# EAGLE design circuito_visualizacion (EAGLE 6.1)
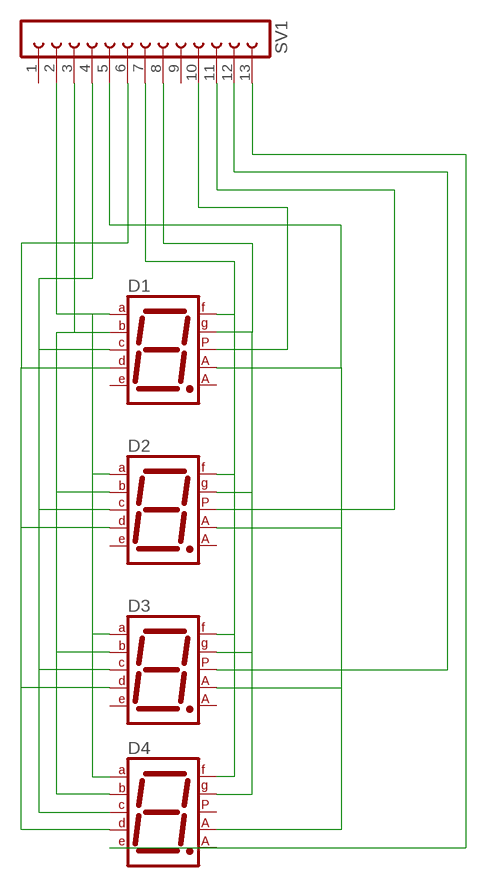
[diagram p0: schematic, sheet 1]

## Parts
D1  7SEG-CA  [7SEG-13]
D2  7SEG-CA  [7SEG-13]
D3  7SEG-CA  [7SEG-13]
D4  7SEG-CA  [7SEG-13]
SV1  FE13-1  [FE13]

## Nets
N$1: D3.5(DP) SV1.12
N$2: D4.1(E) SV1.13
N$3: D1.5(DP) SV1.10
N$5: D1.7(A) D2.7(A) D3.7(A) D4.7(A) SV1.2
N$6: D1.6(B) D2.6(B) D3.6(B) D4.6(B) SV1.3
N$7: D1.4(C) D2.4(C) D3.4(C) D4.4(C) SV1.4
N$8: D1.2(D) D2.2(D) D3.2(D) D4.2(D) SV1.6
N$9: D1.9(F) D2.9(F) D3.9(F) D4.9(F) SV1.7
N$10: D1.10(G) D2.10(G) D3.10(G) D4.10(G) SV1.8
N$11: D2.5(DP) SV1.11
N$12: D1.3(CA1) D2.3(CA1) D3.3(CA1) D4.3(CA1) SV1.5
Unconnected: D1.1(E) D1.8(CA2) D2.1(E) D2.8(CA2) D3.1(E) D3.8(CA2) D4.5(DP) D4.8(CA2) SV1.1 SV1.9

## Library data of the parts
D1-D4 = special:7SEG-CA: 7-segment DISPLAY single anode, 13 mm
SV1 = con-lsta:FE13-1: FEMALE HEADER; OC_FARNELL: unknown; OC_NEWARK: unknown

## Board
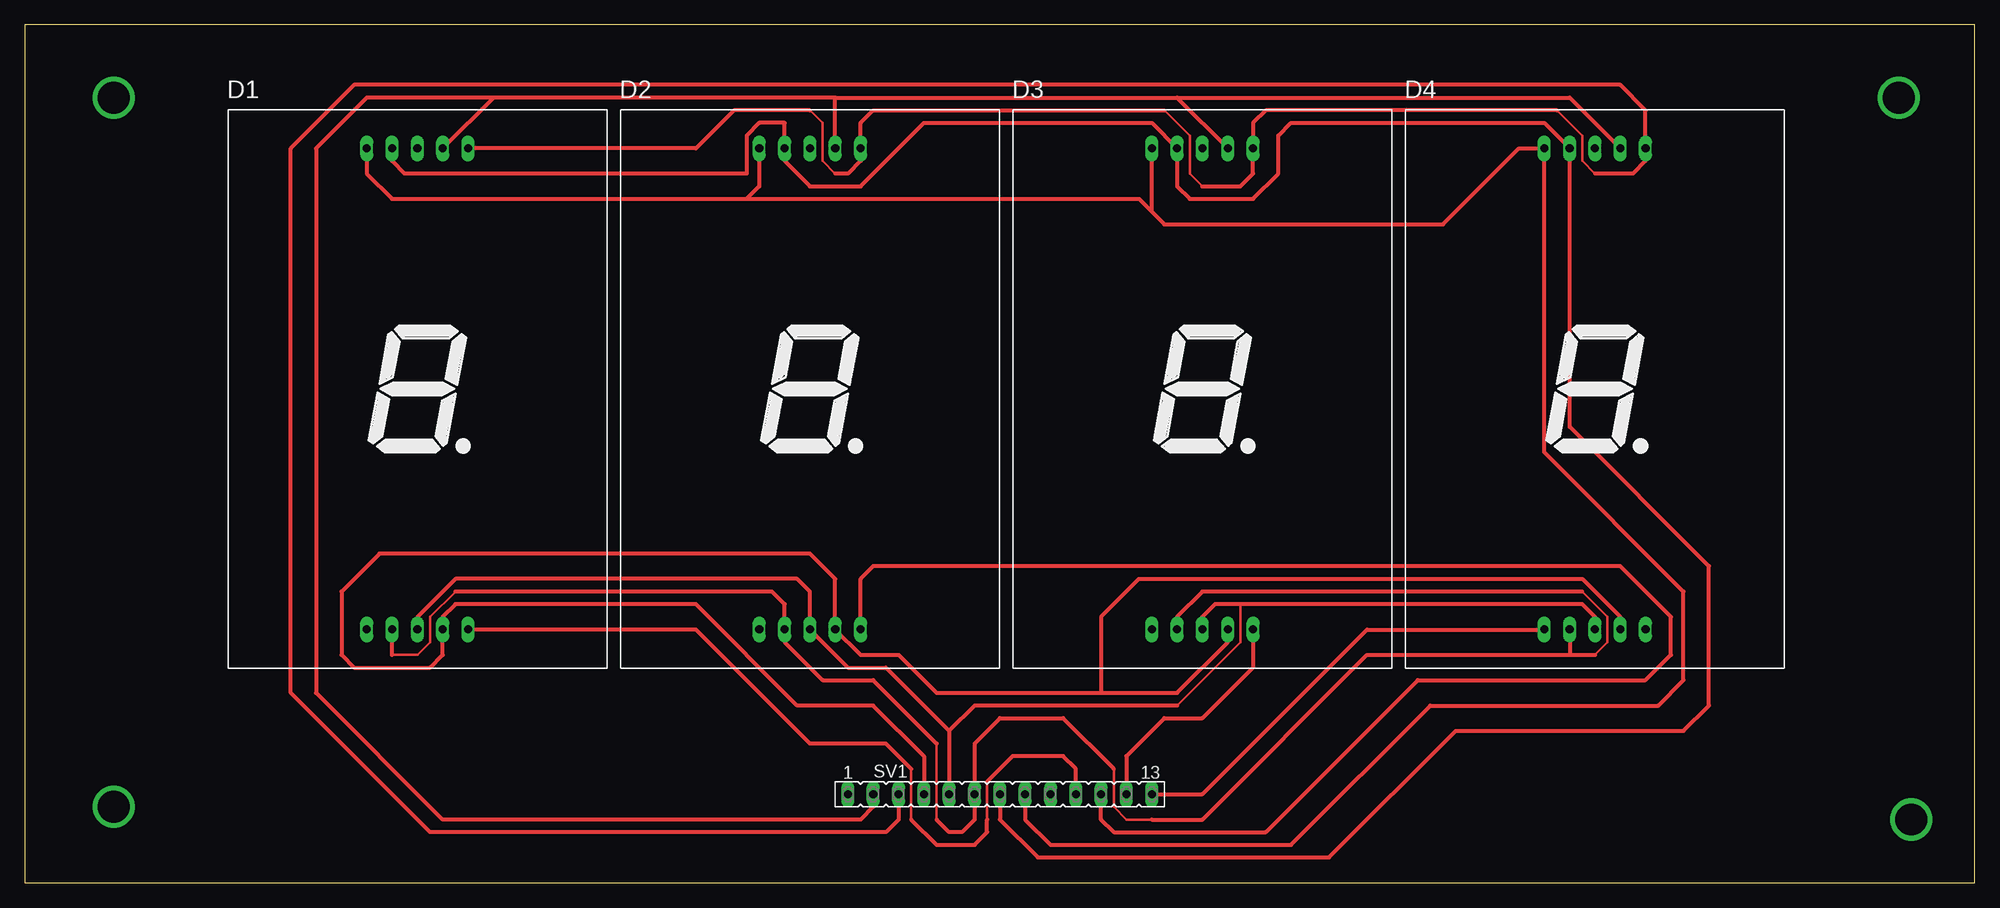
[diagram p1: board, top side]

Size 195.56 x 86.03 mm. Coordinates in mm from the lower left corner, seen from the top.
Outline: 0,0 195.56,0 195.56,86.03 0,86.03 0,0
Copper layers (1*16): Top 0.035mm / dielectric 1.5mm / Bottom 0.035mm
Design rules: minimum track width 16mil, minimum drill 24mil, track to track 8mil, track to pad 8mil, pad to pad 8mil, via to via 8mil, smd to smd 8mil, copper to edge 40mil, drill to drill 8mil, minimum pad ring 10mil, minimum via ring 8mil, stop-mask expansion 4mil, vias tented up to drill 0mil, thermal gap 10mil

### Footprints (pad centres in the part's own frame; a part is rotated, then mirrored left to right if it is on the bottom)
7SEG-13 = drill 0.813 long: 1 -5.08,-24.12; 2 -2.54,-24.12; 3 0,-24.12; 4 2.54,-24.12; 5 5.08,-24.12; 6 5.08,24.12; 7 2.54,24.12; 8 0,24.12; 9 -2.54,24.12; 10 -5.08,24.12
FE13 = drill 0.813 long: 1 -15.24,0; 2 -12.7,0; 3 -10.16,0; 4 -7.62,0; 5 -5.08,0; 6 -2.54,0; 7 0,0; 8 2.54,0; 9 5.08,0; 10 7.62,0; 11 10.16,0; 12 12.7,0; 13 15.24,0

### Placement (x,y rotation side)
D1  39.37,49.53 0 top
D2  78.74,49.53 0 top
D3  118.11,49.53 0 top
D4  157.48,49.53 0 top
SV1  97.79,8.89 0 top

### Tracks (layer width: path | path; a pad name or v marks a point on that pad's centre or on a via)
N$1
  Top 0.406: D3.5 123.19,21.59 118.11,16.51 114.3,16.51 110.49,12.7 SV1.12
N$2
  Top 0.406: D4.1 134.62,25.4 118.11,8.89 SV1.13
N$3
  Top 0.254: 96.52,10.16 96.52,6.35 | 88.9,6.35 88.9,11.43
  Top 0.406: D1.5 67.31,25.4 78.74,13.97 86.36,13.97 88.9,11.43 | SV1.10 105.41,11.43 104.14,12.7 99.06,12.7 96.52,10.16 | 88.9,6.35 91.44,3.81 95.25,3.81 96.52,5.08 96.52,6.35
N$4  (via drill 3.2)
  other vias: 187.96,78.74
N$5
  Top 0.406: 46.99,78.74 D1.7 | D2.7 81.28,78.74 | 115.57,78.74 D3.7 | 81.28,78.74 115.57,78.74 | 115.57,78.74 154.94,78.74 D4.7 | 81.28,78.74 46.99,78.74 | 46.99,78.74 34.29,78.74 29.21,73.66 29.21,19.05 41.91,6.35 83.82,6.35 85.09,7.62 SV1.2
N$6
  Top 0.254: 81.28,71.12 80.01,72.39 80.01,76.2 78.74,77.47 | 114.3,77.47 116.84,74.93 116.84,71.12 118.11,69.85 | 157.48,71.12 156.21,72.39 156.21,74.93 153.67,77.47
  Top 0.406: D1.6 67.31,73.66 71.12,77.47 78.74,77.47 | 81.28,71.12 82.55,71.12 83.82,72.39 D2.6 83.82,76.2 85.09,77.47 114.3,77.47 | 153.67,77.47 124.46,77.47 123.19,76.2 D3.6 123.19,71.12 121.92,69.85 118.11,69.85 | 157.48,71.12 161.29,71.12 162.56,72.39 D4.6 162.56,77.47 160.02,80.01 33.02,80.01 26.67,73.66 26.67,19.05 40.64,5.08 86.36,5.08 87.63,6.35 SV1.3
N$7
  Top 0.406: D4.4 160.02,26.67 156.21,30.48 111.76,30.48 107.95,26.67 107.95,19.05 | 107.95,19.05 91.44,19.05 87.63,22.86 83.82,22.86 D2.4 81.28,30.48 78.74,33.02 35.56,33.02 31.75,29.21 31.75,22.86 33.02,21.59 40.64,21.59 41.91,22.86 D1.4 41.91,26.67 43.18,27.94 67.31,27.94 77.47,17.78 85.09,17.78 90.17,12.7 SV1.4 | 107.95,19.05 115.57,19.05 120.65,24.13 D3.4
N$8
  Top 0.254: 156.21,29.21 158.75,26.67 158.75,24.13 157.48,22.86 | 43.18,29.21 40.64,26.67 40.64,24.13 39.37,22.86 36.83,22.86 | 113.03,6.35 110.49,6.35 109.22,7.62 109.22,11.43 | 91.44,13.97 91.44,6.35
  Top 0.406: 156.21,29.21 118.11,29.21 115.57,26.67 D3.2 | 154.94,22.86 157.48,22.86 | D4.2 154.94,22.86 | 91.44,13.97 85.09,20.32 80.01,20.32 76.2,24.13 D2.2 76.2,27.94 74.93,29.21 43.18,29.21 | 154.94,22.86 134.62,22.86 118.11,6.35 113.03,6.35 | 36.83,22.86 D1.2 | 109.22,11.43 104.14,16.51 97.79,16.51 95.25,13.97 SV1.6 95.25,6.35 93.98,5.08 92.71,5.08 91.44,6.35
N$9
  Top 0.406: D1.9 36.83,72.39 38.1,71.12 72.39,71.12 72.39,74.93 73.66,76.2 76.2,76.2 D2.9 76.2,72.39 78.74,69.85 83.82,69.85 90.17,76.2 113.03,76.2 D3.9 115.57,69.85 116.84,68.58 123.19,68.58 125.73,71.12 125.73,74.93 127,76.2 152.4,76.2 D4.9 154.94,45.72 168.91,31.75 168.91,17.78 166.37,15.24 143.51,15.24 130.81,2.54 101.6,2.54 97.79,6.35 SV1.7
N$10
  Top 0.406: D3.10 113.03,67.31 | 113.03,67.31 114.3,66.04 142.24,66.04 149.86,73.66 D4.10 152.4,43.18 166.37,29.21 166.37,20.32 163.83,17.78 140.97,17.78 127,3.81 102.87,3.81 100.33,6.35 SV1.8 | D1.10 34.29,71.12 36.83,68.58 72.39,68.58 | D2.10 73.66,69.85 72.39,68.58 | 72.39,68.58 111.76,68.58 113.03,67.31
N$11
  Top 0.406: D2.5 83.82,30.48 85.09,31.75 160.02,31.75 165.1,26.67 165.1,22.86 162.56,20.32 139.7,20.32 124.46,5.08 109.22,5.08 107.95,6.35 SV1.11
N$12
  Top 0.254: 121.92,27.94 121.92,24.13 115.57,17.78
  Top 0.406: D4.3 157.48,26.67 156.21,27.94 121.92,27.94 119.38,27.94 118.11,26.67 D3.3 | D1.3 39.37,26.67 43.18,30.48 77.47,30.48 78.74,29.21 D2.3 82.55,21.59 86.36,21.59 92.71,15.24 | 115.57,17.78 95.25,17.78 92.71,15.24 | 92.71,15.24 SV1.5
N$13  (via drill 3.2)
  other vias: 189.23,6.35
N$14  (via drill 3.2)
  other vias: 8.89,78.74
N$15  (via drill 3.2)
  other vias: 8.89,7.62

### Text on the board
tValues: l